# Altium project Transmitter.PrjPcb
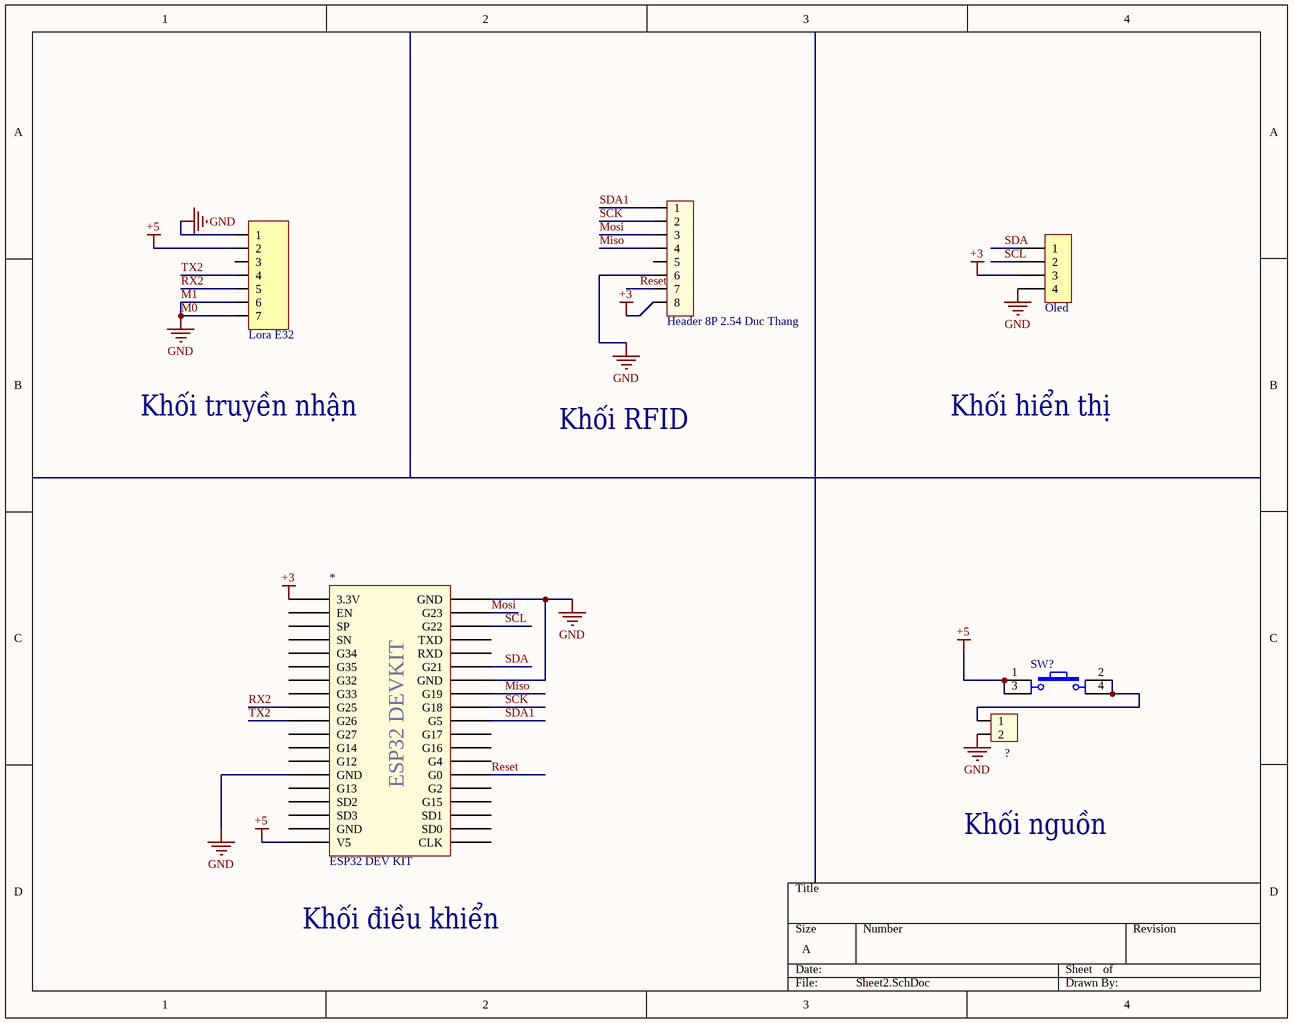
[diagram p0: Sheet2.SchDoc]
1 sheet, 6 parts. Net scope: global (net labels, ports and power ports of the same name join across sheets).
Board file: transmitter.PcbDoc

## Sheet Sheet2.SchDoc
size A; SheetNumber: 1; SheetTotal: 1

### Parts
(Parts that share a designator on the sheet are numbered #1, #2 ... from top to bottom, then left to right.)
*  ESP32 DEV KIT  [ESP32 DEVKIT]
?  Header 2P 2.54 Duc Thang  [XH2.54M-2]  (value not drawn)
H?#1  Header 8P 2.54 Duc Thang  [XH2.54M-8]
H?#2  Oled  [VH3.96M-4]
JP?  Lora E32  [JP 1x7 CT]
SW?  INI PUSH BUTTON SWITCH 4-PIN  [SW_70_31.5D47_TH_ST]  (value not drawn)

### Nets
+3: *.1(3.3V) H?#1.8 H?#2.3
+5: *.19(V5) JP?.2 SW?.1 SW?.3
M0: *.14(GND) *.32(GND) *.38(GND) ?.2 H?#1.6 H?#2.4 JP?.1 JP?.6 JP?.7  [also labelled GND, M1]
Miso: *.31(G19) H?#1.4
Mosi: *.37(G23) H?#1.3
Reset: *.25(G0) H?#1.7
RX2: *.9(G25) JP?.5
SCK: *.30(G18) H?#1.2
SCL: *.36(G22) H?#2.2
SDA: *.33(G21) H?#2.1
SDA1: *.29(G5) H?#1.1
TX2: *.10(G26) JP?.4
Net?_1: ?.1 SW?.2 SW?.4

Not connected (* = marked no-connect by the designer): * 2(EN) 3(SP) 4(SN) 5(G34) 6(G35) 7(G32) 8(G33) 11(G27) 12(G14) 13(G12) 15(G13) 16(SD2) 17(SD3) 18(GND) 20(CLK) 21(SD0) 22(SD1) 23(G15) 24(G2) 26(G4) 27(G16) 28(G17) 34(RXD) 35(TXD); H?#1 5; JP? 3

### Notes on the sheet
- Khối truyền nhận
- Khối RFID
- Khối hiển thị
- Khối nguồn
- Khối điều khiển
- (in symbol ESP32 DEV KIT) ESP32 DEVKIT

### Library data of the parts
? = Header 2P 2.54 Duc Thang: Cắm; Ten_Linh_Kien: Header 2P XH2.54-2P Đực Thẳng; Don_Vi: Con; Ma_Hang: MH001283; Chung_Loai: Cắm
H?#1 = Header 8P 2.54 Duc Thang: Cắm; Ten_Linh_Kien: Header 8P XH2.54-8P Đực Thẳng; Don_Vi: Con; Ma_Hang: MH003366; Chung_Loai: Cắm
H?#2 = Header 4P VH3.96 Duc Thang: Cắm; Ten_Linh_Kien: Header 4P XH2.54-4P Đực Thẳng; Don_Vi: Con; Ma_Hang: MH001285; Chung_Loai: Cắm
JP? = JP 1x7 2.54 Cai Thang: Cắm; Ten_Linh_Kien: Jump Đơn Cái 2.54MM 1x20P Thẳng; Don_Vi: Con; Ma_Hang: MH004006; Ghi_Chu: *; Kieu_Chan: *; Chung_Loai: Cắm
SW? = SW2_BUTT-4-TH: Tactile Switches MINI PUSH BUTTON SWITCH 4-PIN QTY. 4; Manufacturer: Gravitech; Manufacturer Part Number: BUTT-4; Alternate Part Number-1: NA; Case/Package: TH; Supplier-1: SP ROAD; Supplier Part Number-1: BUTT-4